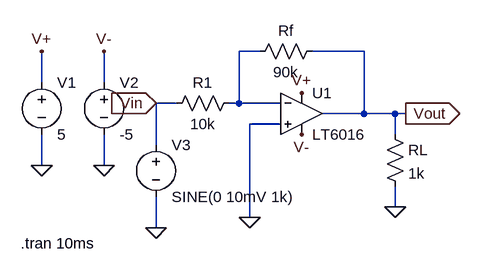
[diagram p0: schematic Task 3 – Inverting Amplifier.asc]
Task 3 – Inverting Amplifier.asc, the LTspice schematic file:
Version 4.1
SHEET 1 880 680
WIRE 208 48 176 48
WIRE 368 48 288 48
WIRE -128 96 -128 48
WIRE -32 96 -32 48
WIRE 80 128 48 128
WIRE 176 128 176 48
WIRE 176 128 160 128
WIRE 240 128 176 128
WIRE 368 144 368 48
WIRE 368 144 304 144
WIRE 416 144 368 144
WIRE 432 144 416 144
WIRE 240 160 192 160
WIRE 416 176 416 144
WIRE 48 192 48 128
WIRE -128 224 -128 176
WIRE -32 224 -32 176
WIRE 416 288 416 256
WIRE 192 304 192 160
WIRE 48 320 48 272
FLAG 432 144 Vout
IOPIN 432 144 Out
FLAG -128 224 0
FLAG -32 224 0
FLAG 416 288 0
FLAG -128 48 V+
FLAG -32 48 V-
FLAG 272 112 V+
FLAG 272 176 V-
FLAG 48 320 0
FLAG 192 304 0
FLAG 48 128 Vin
IOPIN 48 128 In
SYMBOL voltage -128 80 R0
SYMATTR InstName V1
SYMATTR Value 5
SYMBOL voltage -32 80 R0
SYMATTR InstName V2
SYMATTR Value -5
SYMBOL res 400 160 R0
SYMATTR InstName RL
SYMATTR Value 1k
SYMBOL OpAmps\\LT6016 272 144 R0
SYMATTR InstName U1
SYMBOL voltage 48 176 R0
WINDOW 123 0 0 Left 0
WINDOW 39 0 0 Left 0
SYMATTR InstName V3
SYMATTR Value SINE(0 10mV 1k)
SYMBOL res 304 32 R90
WINDOW 0 0 56 VBottom 2
WINDOW 3 32 56 VTop 2
SYMATTR InstName Rf
SYMATTR Value 90k
SYMBOL res 176 112 R90
WINDOW 0 0 56 VBottom 2
WINDOW 3 32 56 VTop 2
SYMATTR InstName R1
SYMATTR Value 10k
TEXT -160 344 Left 2 !.tran 10ms

The netlist it stands for:
* Task 3 – Inverting Amplifier.asc
V1 V+ 0 5
V2 V- 0 -5
RL Vout 0 1k
* U1: LT6016 (symbol OpAmps\LT6016 not available, pins judged from their places): In+=0 In-=N001 V+=V+ V-=V- OUT=Vout
V3 Vin 0 SINE(0 10mV 1k)
Rf Vout N001 90k
R1 N001 Vin 10k
.tran 10ms
.backanno
.end